# Altium schematic sheet Aux_Lights_Power_Conversion.SchDoc
size A; SheetNumber: 1; SheetTotal: 2
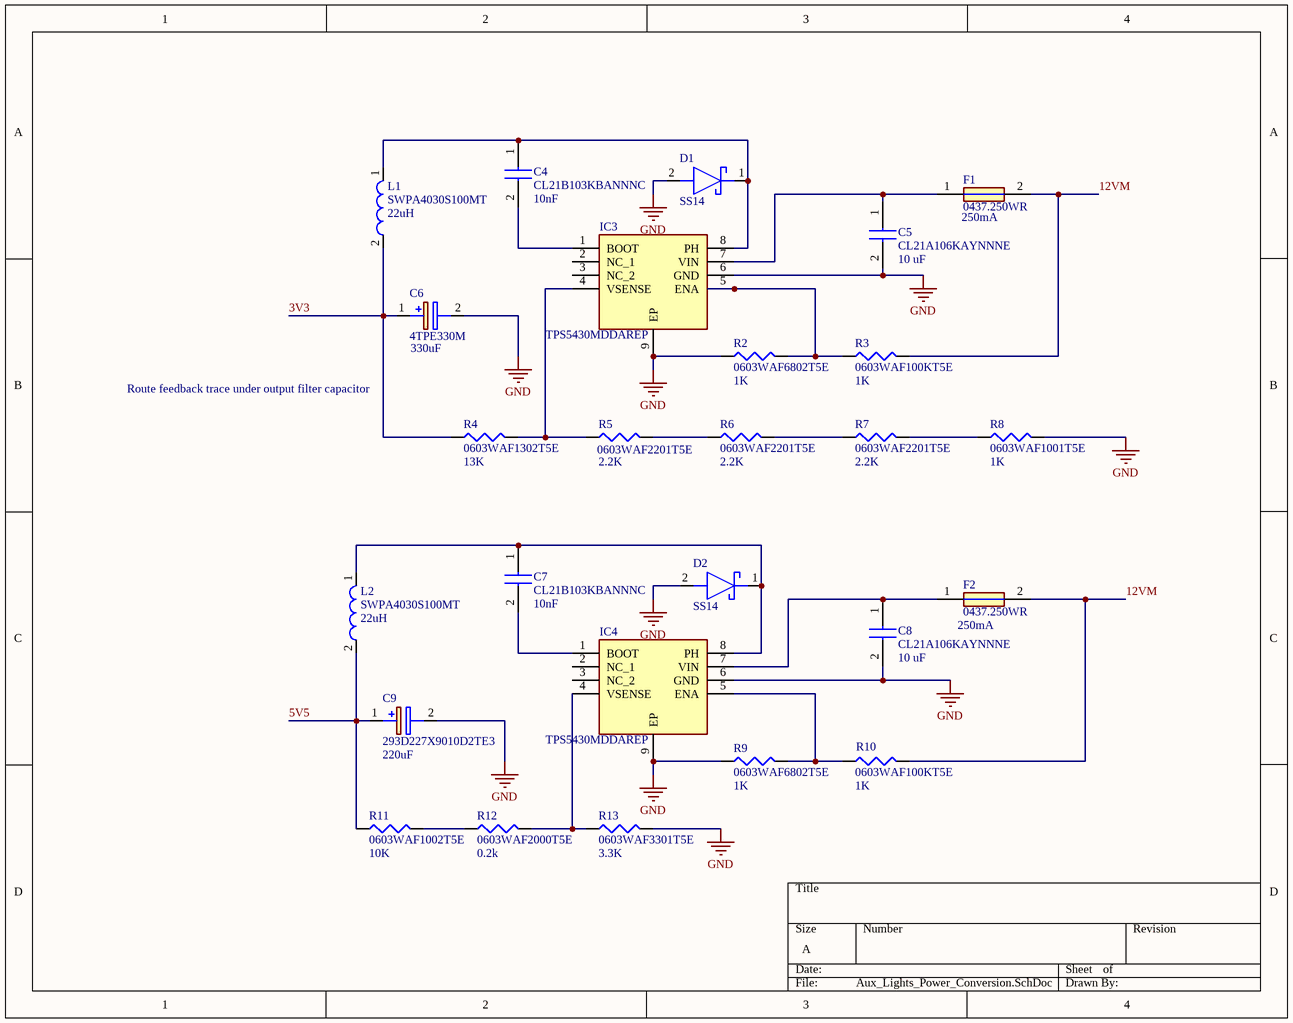
[diagram p0: Aux_Lights_Power_Conversion.SchDoc]

## Parts
C4  CL21B103KBANNNC  value 10nF  [CAPC2012X65N]
C5  CL21A106KAYNNNE  value 10 uF  [CAPC2012X145N]
C6  4TPE330M  value 330uF  [POSCAP_D12_D15_D15E_D2E_D2_D3L_D4]
C7  CL21B103KBANNNC  value 10nF  [CAPC2012X65N]
C8  CL21A106KAYNNNE  value 10 uF  [CAPC2012X145N]
C9  293D227X9010D2TE3  value 220uF  [CAPPM7343X310N]
D1  SS14  [DIONM5327X242N]
D2  SS14  [DIONM5327X242N]
F1  0437.250WR  value 250mA  [FUSC3216X86N]
F2  0437.250WR  value 250mA  [FUSC3216X86N]
IC3  TPS5430MDDAREP  [SOIC127P600X170-9N]
IC4  TPS5430MDDAREP  [SOIC127P600X170-9N]
L1  SWPA4030S100MT  value 22uH  [SWPA4030S100MT]
L2  SWPA4030S100MT  value 22uH  [SWPA4030S100MT]
R2  0603WAF6802T5E  value 1K  [J1-0603]
R3  0603WAF100KT5E  value 1K  [J1-0603]
R4  0603WAF1302T5E  value 13K  [J1-0603]
R5  0603WAF2201T5E  value 2.2K  [J1-0603]
R6  0603WAF2201T5E  value 2.2K  [J1-0603]
R7  0603WAF2201T5E  value 2.2K  [J1-0603]
R8  0603WAF1001T5E  value 1K  [J1-0603]
R9  0603WAF6802T5E  value 1K  [J1-0603]
R10  0603WAF100KT5E  value 1K  [J1-0603]
R11  0603WAF1002T5E  value 10K  [J1-0603]
R12  0603WAF2000T5E  value 0.2k  [J1-0603]
R13  0603WAF3301T5E  value 3.3K  [J1-0603]

## Nets
GND: C5.2 C6.2(-) C8.2 C9.2(-) D1.2(A) D2.2(A) IC3.6(GND) IC3.9(EP) IC4.6(GND) IC4.9(EP) R2.1 R8.2 R9.1 R13.2
3V3: C6.1(+) L1.2 R4.1
5V5: C9.1(+) L2.2 R11.1
12VM: F1.2 F2.2 R3.2 R10.2
NetC4_1: C4.1 D1.1(K) IC3.8(PH) L1.1
NetC4_2: C4.2 IC3.1(BOOT)
NetC5_1: C5.1 F1.1 IC3.7(VIN)
NetC7_1: C7.1 D2.1(K) IC4.8(PH) L2.1
NetC7_2: C7.2 IC4.1(BOOT)
NetC8_1: C8.1 F2.1 IC4.7(VIN)
NetIC3_4: IC3.4(VSENSE) R4.2 R5.1
NetIC3_5: IC3.5(ENA) R2.2 R3.1
NetIC4_4: IC4.4(VSENSE) R12.2 R13.1
NetIC4_5: IC4.5(ENA) R9.2 R10.1
NetR5_2: R5.2 R6.1
NetR6_2: R6.2 R7.1
NetR7_2: R7.2 R8.1
NetR11_2: R11.2 R12.1

Not connected (* = marked no-connect by the designer): IC3 2(NC_1) 3(NC_2); IC4 2(NC_1) 3(NC_2)

## Notes on the sheet
- Route feedback trace under output filter capacitor

## Library data of the parts
C4 C7 = CL21B103KBANNNC: Capacitor; Manufacturer_Name: Samsung Electro-Mechanics; Datasheet Link: https://datasheet.datasheetarchive.com/originals/distributors/Datasheets_SAMA/97c54fb7f716f6f5bd35dfc2c9b17795.pdf; Height: 0.65mm; Manufacturer_Part_Number: CL21B103KBANNNC
C5 C8 = CL21A106KAYNNNE: Capacitor; Manufacturer_Name: Samsung Electro-Mechanics; Datasheet Link: https://datasheet.datasheetarchive.com/originals/distributors/Datasheets_SAMA/6a45835c9b7400e9b49c55c38a8ff4a2.pdf; Height: 1.45mm; Manufacturer_Part_Number: CL21A106KAYNNNE
C6 = 4TPE330M: Capacitor Polarised; Manufacturer_Name: Panasonic; Datasheet Link: http://industrial.panasonic.com/cdbs/www-data/pdf/AAA8000/AAA8000C36.pdf; Manufacturer_Part_Number: 4TPE330M
C9 = 293D227X9010D2TE3: Capacitor Polarised; Manufacturer_Name: Vishay; Datasheet Link: http://www.vishay.com/doc?40002; Height: 3.1mm; Manufacturer_Part_Number: 293D227X9010D2TE3
D1 D2 = SS14: Schottky Diode; Manufacturer_Name: MDD(Microdiode Electronics); Datasheet Link: https://datasheet.lcsc.com/szlcsc/1903051003_MDD-Jiangsu-Yutai-Elec-SS14_C2480.pdf; Height: 2.42mm; Manufacturer_Part_Number: SS14
F1 F2 = 0437.250WR: Fuse; Manufacturer_Name: LITTELFUSE; Datasheet Link: https://m.littelfuse.com/~/media/electronics/datasheets/fuses/littelfuse_fuse_437_datasheet.pdf.pdf; Height: 0.864mm; Manufacturer_Part_Number: 0437.250WR
IC3 IC4 = TPS5430MDDAREP: Integrated Circuit; Manufacturer_Name: Texas Instruments; Datasheet Link: http://www.ti.com/lit/gpn/tps5430-ep; Height: 1.7mm; Mouser2 Part Number: 595-TPS5430MDDAREP; Mouser2 Price/Stock: https://www.mouser.com/Search/Refine.aspx?Keyword=595-TPS5430MDDAREP; Manufacturer_Part_Number: TPS5430MDDAREP
R2-R13 = Res3: Resistor; Published: 8-Jun-2000; LatestRevisionDate: 29-May-2009; LatestRevisionNote: IPC-7351 Footprint Added.; PackageReference: J1-0603; Publisher: Altium Limited; PackageDescription: Chip Resistor